# EAGLE schematic Edison_Mezzanine_I2C_Breakout (EAGLE 6.5.0)

## Sheet 1 of 2
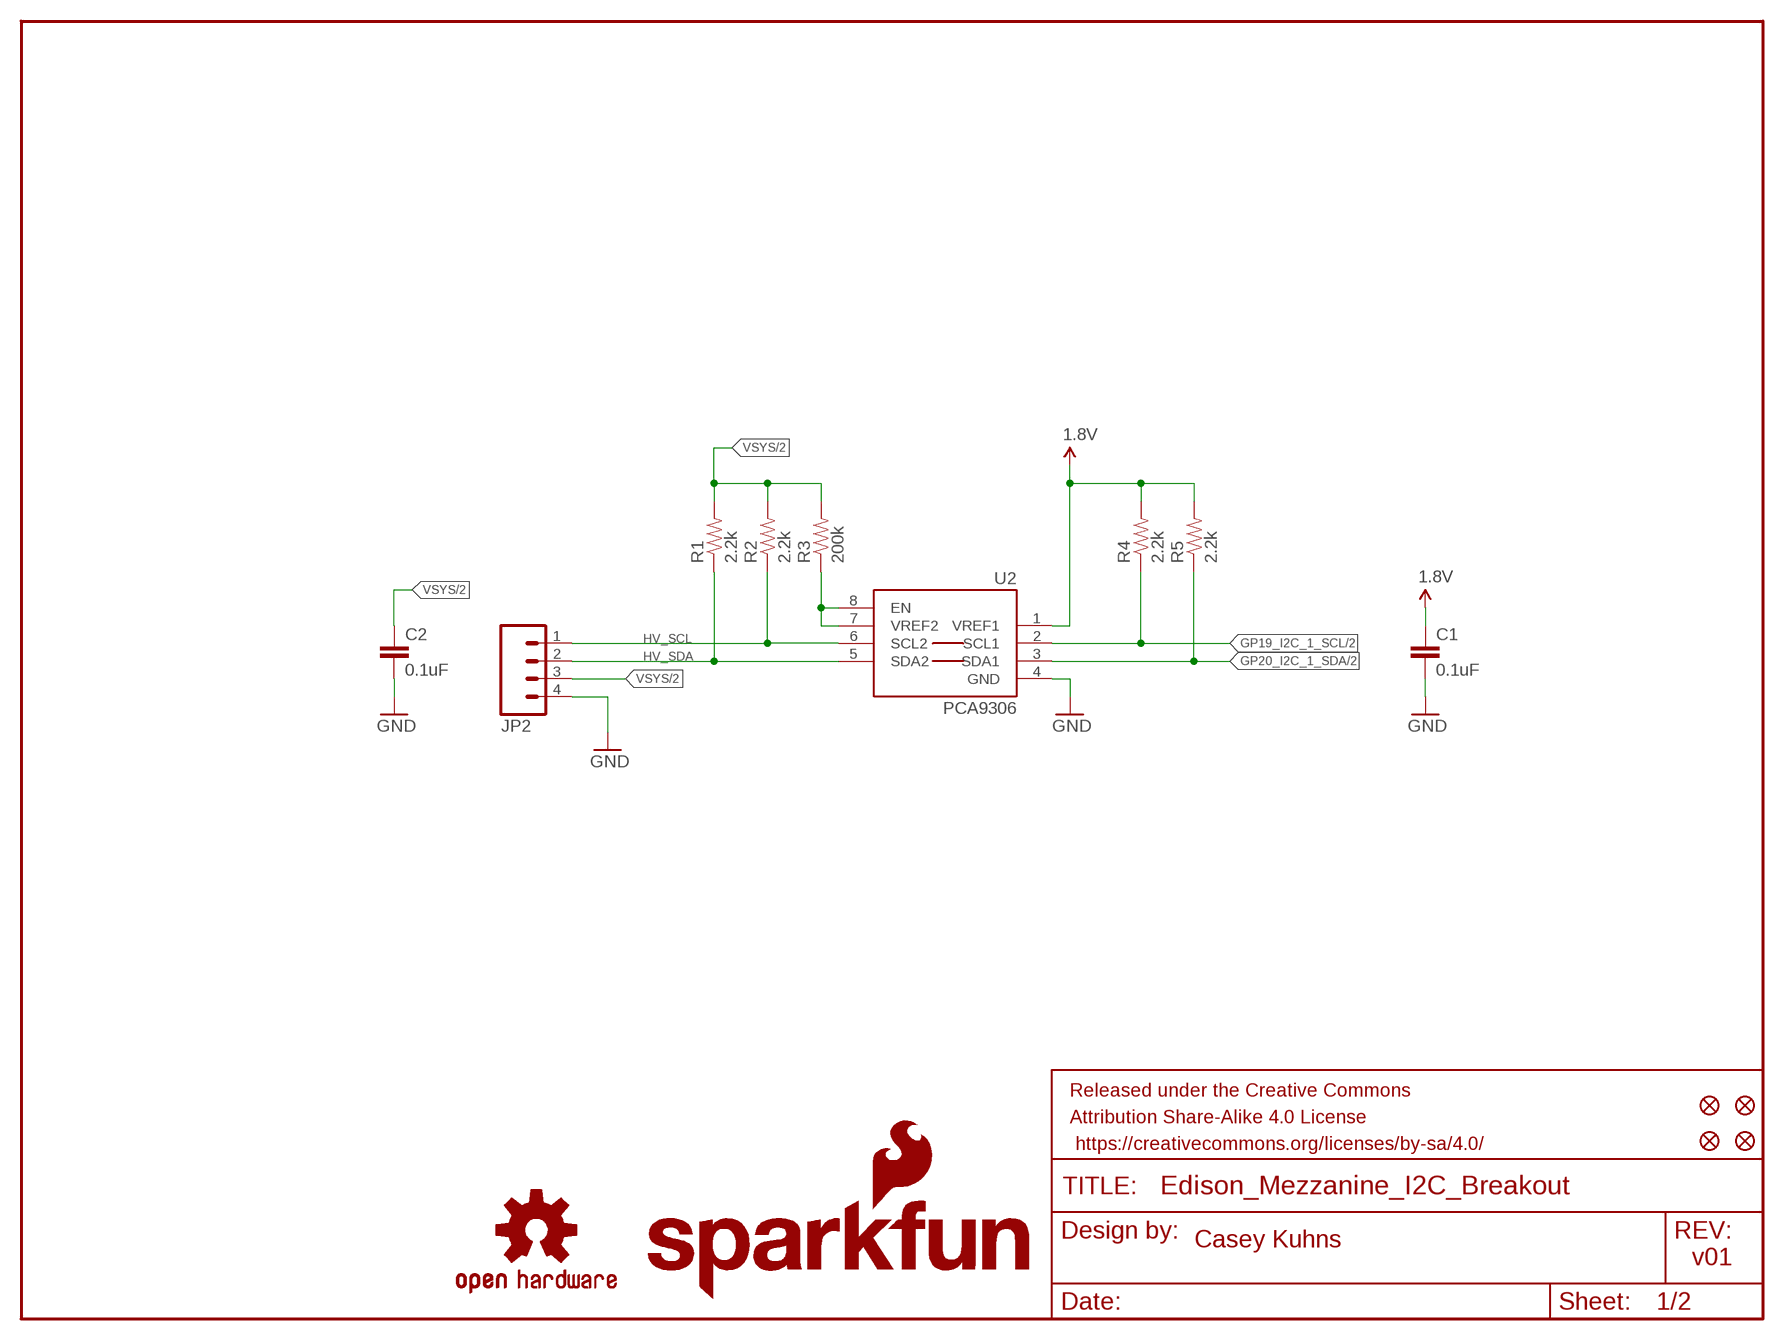
[diagram p0: schematic, sheet 1]

### Parts
C1  0.1uF  0.1UF-25V(+80/-20%)(0603)  [0603-CAP]
C2  0.1uF  0.1UF-25V(+80/-20%)(0603)  [0603-CAP]
FID1  FIDUCIAL1X2  [FIDUCIAL-1X2]
FID2  FIDUCIAL1X2  [FIDUCIAL-1X2]
FID3  FIDUCIAL1X2  [FIDUCIAL-1X2]
FID4  FIDUCIAL1X2  [FIDUCIAL-1X2]
FRAME1  FRAME-LETTER  [CREATIVE_COMMONS]
JP2  M04SMD_RA_FEMALE  [1X04_SMD_RA_FEMALE]
LOGO1  SFE_LOGO_NAME_FLAME.1_INCH  [SFE_LOGO_NAME_FLAME_.1]
LOGO2  OSHW-LOGOS  [OSHW-LOGO-S]
LOGO3  SFE_LOGO_NAME_FLAME.1_INCH  [SFE_LOGO_NAME_FLAME_.1]
LOGO4  OSHW-LOGOS  [OSHW-LOGO-S]
R1  2.2k  2.2KOHM1/10W1%(0603)  [0603-RES]
R2  2.2k  2.2KOHM1/10W1%(0603)  [0603-RES]
R3  200k  200KOHM1/10W1%(0603)200K  [0603-RES]
R4  2.2k  2.2KOHM1/10W1%(0603)  [0603-RES]
R5  2.2k  2.2KOHM1/10W1%(0603)  [0603-RES]
U2  PCA9306  PCA9306PCA9306DC-1:1  [PCA9306DC-1:1]

### Nets
1.8V: C1.1 R4.2 R5.2 U2.1(VREF1) ; also sheet 2
GND: C1.2 C2.2 JP2.4 U2.4(GND) ; also sheet 2
GP19_I2C_1_SCL: R4.1 U2.2(SCL1) ; also sheet 2
GP20_I2C_1_SDA: R5.1 U2.3(SDA1) ; also sheet 2
HV_SCL: JP2.1 R2.1 U2.6(SCL2)
HV_SDA: JP2.2 R1.1 U2.5(SDA2)
N$1: R3.1 U2.7(VREF2) U2.8(EN)
VSYS: C2.1 JP2.3 R1.2 R2.2 R3.2 ; also sheet 2

### Notes on the sheet
- Casey Kuhns
- v01

## Sheet 2 of 2
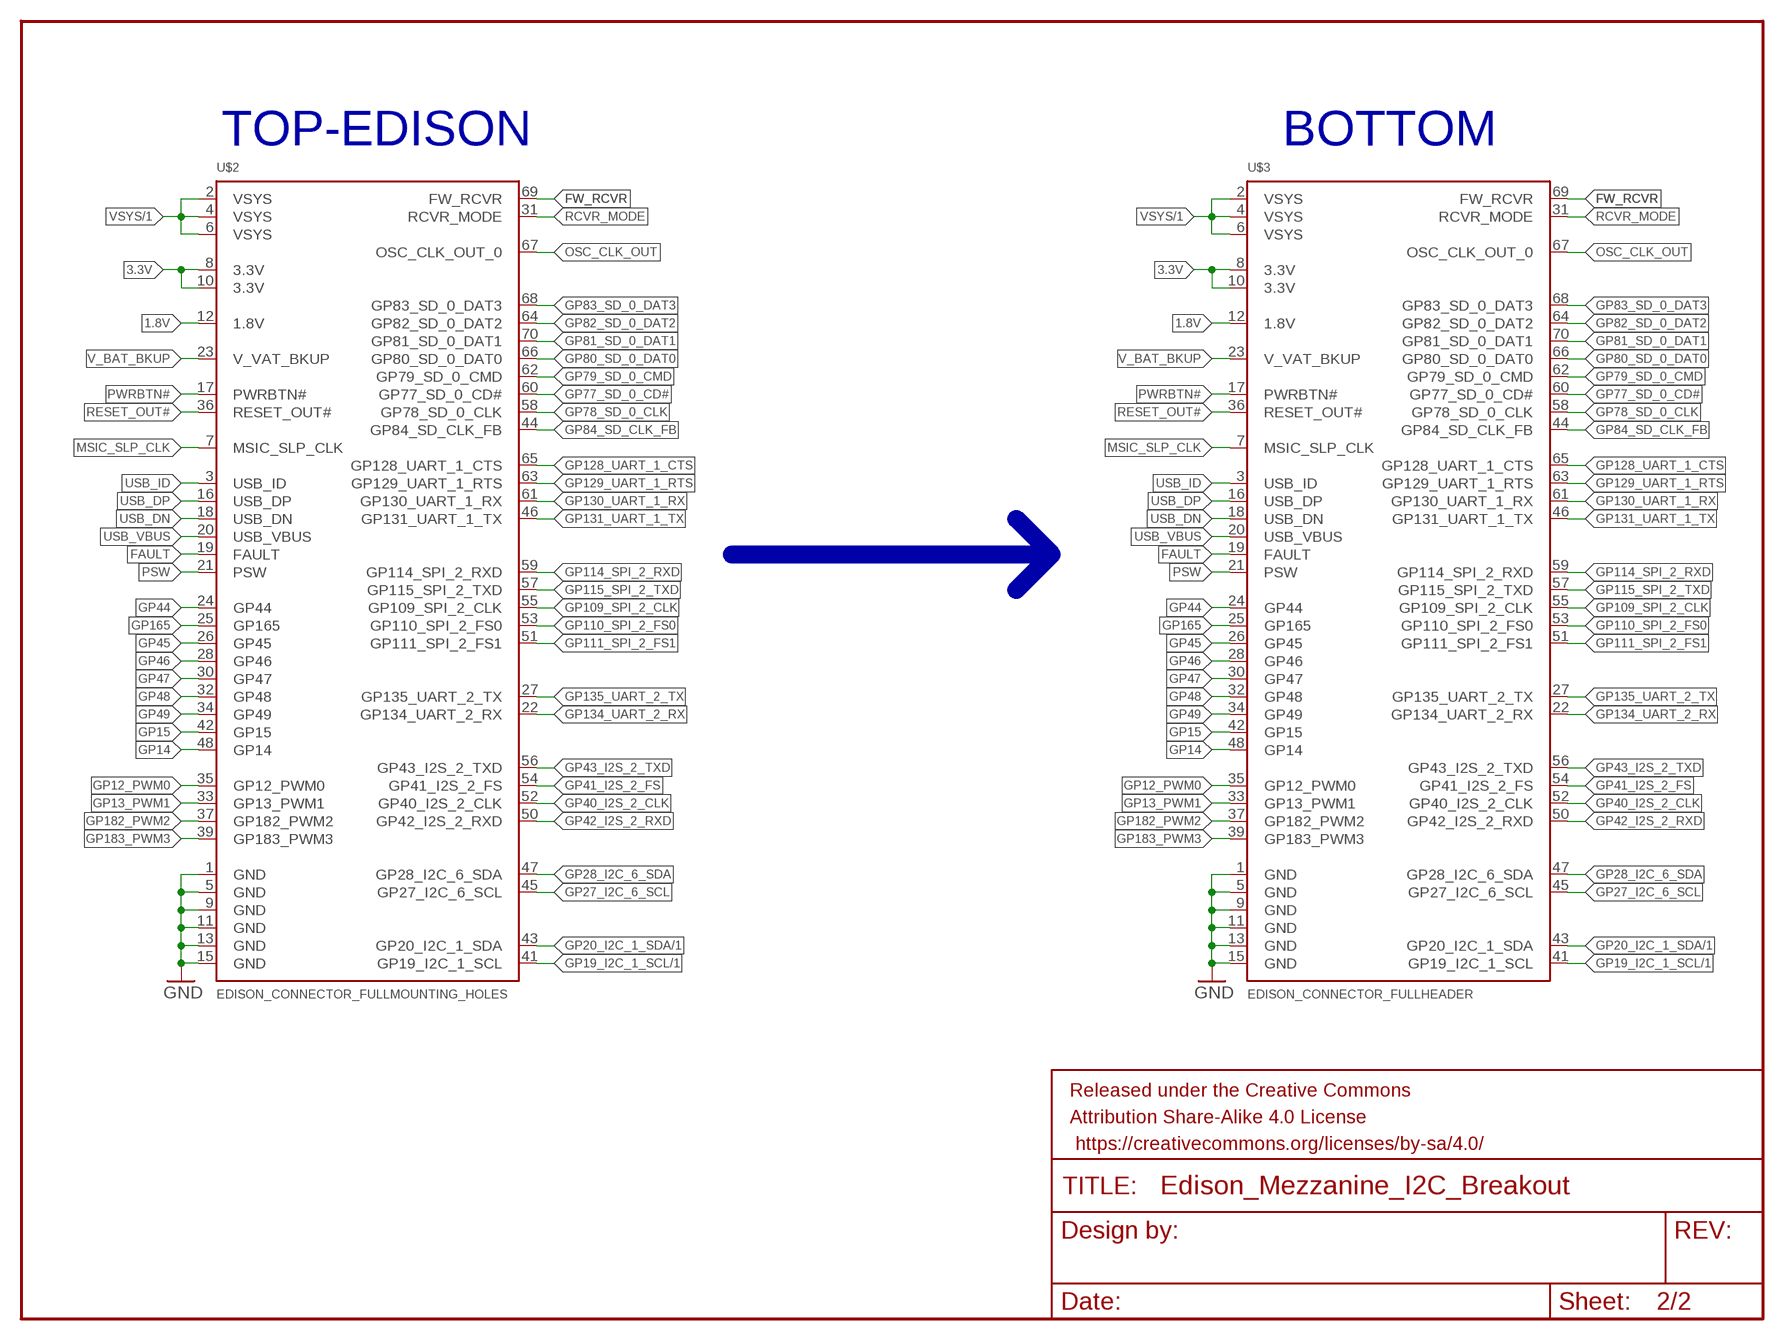
[diagram p1: schematic, sheet 2]

### Parts
FRAME2  FRAME-LETTER  [CREATIVE_COMMONS]
U$2  EDISON_CONNECTOR_FULLMOUNTING_HOLES  [EDISON_DAUGHTER]
U$3  EDISON_CONNECTOR_FULLHEADER  [DF40C-70DP-0.4(51)]

### Nets
1.8V: U$2.12(1.8V) U$3.12(1.8V) ; also sheet 1
3.3V: U$2.8(3.3V) U$2.10(3.3V) U$3.8(3.3V) U$3.10(3.3V)
FAULT: U$2.19(FAULT) U$3.19(FAULT)
FW_RCVR: U$2.69(FW_RCVR) U$3.69(FW_RCVR)
GND: U$2.1(GND) U$2.5(GND) U$2.9(GND) U$2.11(GND) U$2.13(GND) U$2.15(GND) U$3.1(GND) U$3.5(GND) U$3.9(GND) U$3.11(GND) U$3.13(GND) U$3.15(GND) ; also sheet 1
GP12_PWM0: U$2.35(GP12_PWM0) U$3.35(GP12_PWM0)
GP13_PWM1: U$2.33(GP13_PWM1) U$3.33(GP13_PWM1)
GP14: U$2.48(GP14) U$3.48(GP14)
GP15: U$2.42(GP15) U$3.42(GP15)
GP19_I2C_1_SCL: U$2.41(GP19_I2C_1_SCL) U$3.41(GP19_I2C_1_SCL) ; also sheet 1
GP20_I2C_1_SDA: U$2.43(GP20_I2C_1_SDA) U$3.43(GP20_I2C_1_SDA) ; also sheet 1
GP27_I2C_6_SCL: U$2.45(GP27_I2C_6_SCL) U$3.45(GP27_I2C_6_SCL)
GP28_I2C_6_SDA: U$2.47(GP28_I2C_6_SDA) U$3.47(GP28_I2C_6_SDA)
GP40_I2S_2_CLK: U$2.52(GP40_I2S_2_CLK) U$3.52(GP40_I2S_2_CLK)
GP41_I2S_2_FS: U$2.54(GP41_I2S_2_FS) U$3.54(GP41_I2S_2_FS)
GP42_I2S_2_RXD: U$2.50(GP42_I2S_2_RXD) U$3.50(GP42_I2S_2_RXD)
GP43_I2S_2_TXD: U$2.56(GP43_I2S_2_TXD) U$3.56(GP43_I2S_2_TXD)
GP44: U$2.24(GP44) U$3.24(GP44)
GP45: U$2.26(GP45) U$3.26(GP45)
GP46: U$2.28(GP46) U$3.28(GP46)
GP47: U$2.30(GP47) U$3.30(GP47)
GP48: U$2.32(GP48) U$3.32(GP48)
GP49: U$2.34(GP49) U$3.34(GP49)
GP77_SD_0_CD#: U$2.60(GP77_SD_0_CD#) U$3.60(GP77_SD_0_CD#)
GP78_SD_0_CLK: U$2.58(GP78_SD_0_CLK) U$3.58(GP78_SD_0_CLK)
GP79_SD_0_CMD: U$2.62(GP79_SD_0_CMD) U$3.62(GP79_SD_0_CMD)
GP80_SD_0_DAT0: U$2.66(GP80_SD_0_DAT0) U$3.66(GP80_SD_0_DAT0)
GP81_SD_0_DAT1: U$2.70(GP81_SD_0_DAT1) U$3.70(GP81_SD_0_DAT1)
GP82_SD_0_DAT2: U$2.64(GP82_SD_0_DAT2) U$3.64(GP82_SD_0_DAT2)
GP83_SD_0_DAT3: U$2.68(GP83_SD_0_DAT3) U$3.68(GP83_SD_0_DAT3)
GP84_SD_CLK_FB: U$2.44(GP84_SD_CLK_FB) U$3.44(GP84_SD_CLK_FB)
GP109_SPI_2_CLK: U$2.55(GP109_SPI_2_CLK) U$3.55(GP109_SPI_2_CLK)
GP110_SPI_2_FS0: U$2.53(GP110_SPI_2_FS0) U$3.53(GP110_SPI_2_FS0)
GP111_SPI_2_FS1: U$2.51(GP111_SPI_2_FS1) U$3.51(GP111_SPI_2_FS1)
GP114_SPI_2_RXD: U$2.59(GP114_SPI_2_RXD) U$3.59(GP114_SPI_2_RXD)
GP115_SPI_2_TXD: U$2.57(GP115_SPI_2_TXD) U$3.57(GP115_SPI_2_TXD)
GP128_UART_1_CTS: U$2.65(GP128_UART_1_CTS) U$3.65(GP128_UART_1_CTS)
GP129_UART_1_RTS: U$2.63(GP129_UART_1_RTS) U$3.63(GP129_UART_1_RTS)
GP130_UART_1_RX: U$2.61(GP130_UART_1_RX) U$3.61(GP130_UART_1_RX)
GP131_UART_1_TX: U$2.46(GP131_UART_1_TX) U$3.46(GP131_UART_1_TX)
GP134_UART_2_RX: U$2.22(GP134_UART_2_RX) U$3.22(GP134_UART_2_RX)
GP135_UART_2_TX: U$2.27(GP135_UART_2_TX) U$3.27(GP135_UART_2_TX)
GP165: U$2.25(GP165) U$3.25(GP165)
GP182_PWM2: U$2.37(GP182_PWM2) U$3.37(GP182_PWM2)
GP183_PWM3: U$2.39(GP183_PWM3) U$3.39(GP183_PWM3)
MSIC_SLP_CLK: U$2.7(MSIC_SLP_CLK) U$3.7(MSIC_SLP_CLK)
OSC_CLK_OUT: U$2.67(OSC_CLK_OUT_0) U$3.67(OSC_CLK_OUT_0)
PSW: U$2.21(PSW) U$3.21(PSW)
PWRBTN#: U$2.17(PWRBTN#) U$3.17(PWRBTN#)
RCVR_MODE: U$2.31(RCVR_MODE) U$3.31(RCVR_MODE)
RESET_OUT#: U$2.36(RESET_OUT#) U$3.36(RESET_OUT#)
USB_DN: U$2.18(USB_DN) U$3.18(USB_DN)
USB_DP: U$2.16(USB_DP) U$3.16(USB_DP)
USB_ID: U$2.3(USB_ID) U$3.3(USB_ID)
USB_VBUS: U$2.20(USB_VBUS) U$3.20(USB_VBUS)
V_BAT_BKUP: U$2.23(V_VAT_BKUP) U$3.23(V_VAT_BKUP)
VSYS: U$2.2(VSYS) U$2.4(VSYS) U$2.6(VSYS) U$3.2(VSYS) U$3.4(VSYS) U$3.6(VSYS) ; also sheet 1

### Buses
B$1

### Notes on the sheet
- TOP-EDISON | BOTTOM

## Library data of the parts
C1 C2 = SparkFun-Capacitors:0.1UF-25V(+80/-20%)(0603): CAP-00810 Ceramic Standard decoupling cap; PROD_ID: CAP-00810
FID1-FID4 = SparkFun-Aesthetics:FIDUCIAL: Fiducial Alignment Points Various fiducial points for machine vision alignment.
FRAME1 FRAME2 = SparkFun-Aesthetics:FRAME-LETTER: Schematic Frame Standard 8.5x11 US Letter frame
JP2 = SparkFun-Connectors:M04: Header 4 Standard 4-pin 0.1" header. Use with straight break away headers (SKU : PRT-00116), right angle break away headers (PRT-00553), swiss pins (PRT-00743), machine pins (PRT-00117), and female headers (PRT-00115). Molex polarized connector foot print use with SKU : PRT-08231 with associated crimp pins and housings. 1MM SMD Version SKU: PRT-10208
LOGO1 LOGO3 = SparkFun-Aesthetics:SFE_LOGO_NAME_FLAME: SFE Logo, name and flame This is the SparkFun full logo. The logo on the schematic will always be the same size; the package variant is the height of the flame part of the logo. Default layer for the logo on the board is tSilk.
LOGO2 LOGO4 = SparkFun-Aesthetics:OSHW-LOGO: Open Source Hardware Logo This logo indicates the piece of hardware it is found on incorporates a OSHW license and/or adheres to the definition of open source hardware found here: http://freedomdefined.org/OSHW
R1 R2 R4 R5 = SparkFun-Resistors:2.2KOHM1/10W1%(0603): RES-08272; PROD_ID: RES-08272
R3 = SparkFun-Resistors:200KOHM1/10W1%(0603): RES-09385; PROD_ID: RES-09385
U2 = SparkFun-DigitalIC:PCA9306: Bidirectional I2C level shifter. NOT compatible with all available part number pinout schemes- DOUBLE CHECK!!!; PROD_ID: IC-10023
U$2 U$3 = Edison:EDISON_CONNECTOR_FULL